# EasyEDA schematic HW1_62.json
TITLE: Sheet_1; REV: 1.0; Date: 2020-11-04; Sheet: 1/1; Drawn By: gokbeykeskin_4066; Company: Your Company
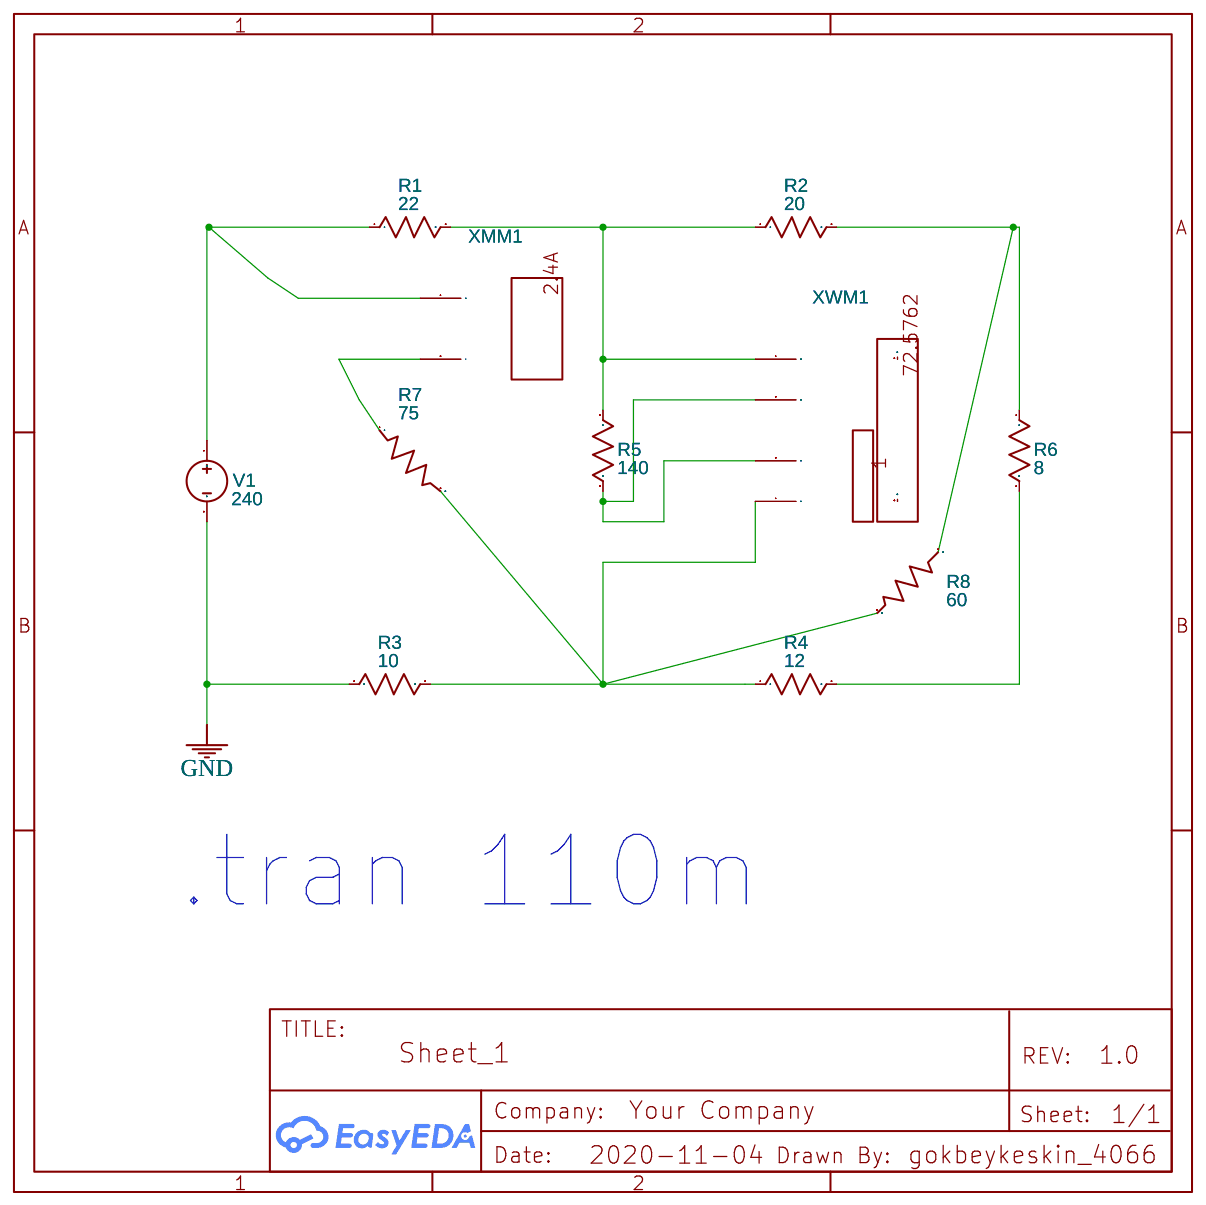
[diagram p0: schematic sheet]

## Parts
R1  22  [AXIAL-0.3]
R2  20  [AXIAL-0.3]
R3  10  [AXIAL-0.3]
R4  12  [AXIAL-0.3]
R5  140  [AXIAL-0.3]
R6  8  [AXIAL-0.3]
R7  75  [AXIAL-0.3]
R8  60  [AXIAL-0.3]
V1  240  [HDR1X2]
XMM1  Multimeter
XWM1  Wattmeter

## Library data of the parts
R1-R6 = Resistor_US: Resistance: 1k; Contributor: EasyEDA; Supplier: YUJING
R7 R8 = Resistor_45Degree_US: Supplier: YUJING; Contributor: EasyEDA; Resistance: 1K
V1 = VDC: Contributor: EasyEDA; sim: true
XMM1 = MULTIMETER: Supplier: LCSC; Multimeter Type: Amper; Power Type: AC; Voltmeter resistance: 10μ; Ammeter resistance: 1G; NameDisplay: 0; Contributor: EasyEDA; sim: true
XWM1 = WATTMETER: Contributor: EasyEDA; NameDisplay: 0; sim: true

## Nets
GND: R3.1 V1.2
Net-(R1-1): R1.1 V1.1 XMM1.1(+)
Net-(R1-2): R1.2 R2.1 R5.1 XWM1.1(V+)
Net-(R2-2): R2.2 R6.1 R8.1
Net-(R3-2): R3.2 R4.1 R7.2 R8.2 XWM1.4(I-)
Net-(R4-2): R4.2 R6.2
Net-(R5-2): R5.2 XWM1.2(V-) XWM1.3(I+)
Net-(R7-1): R7.1 XMM1.2(I)

Not connected (* = marked no-connect by the designer): XWM1 P PF

## Notes on the sheet
- .tran 110m
